# EAGLE design evolvulator (EAGLE 6.1)
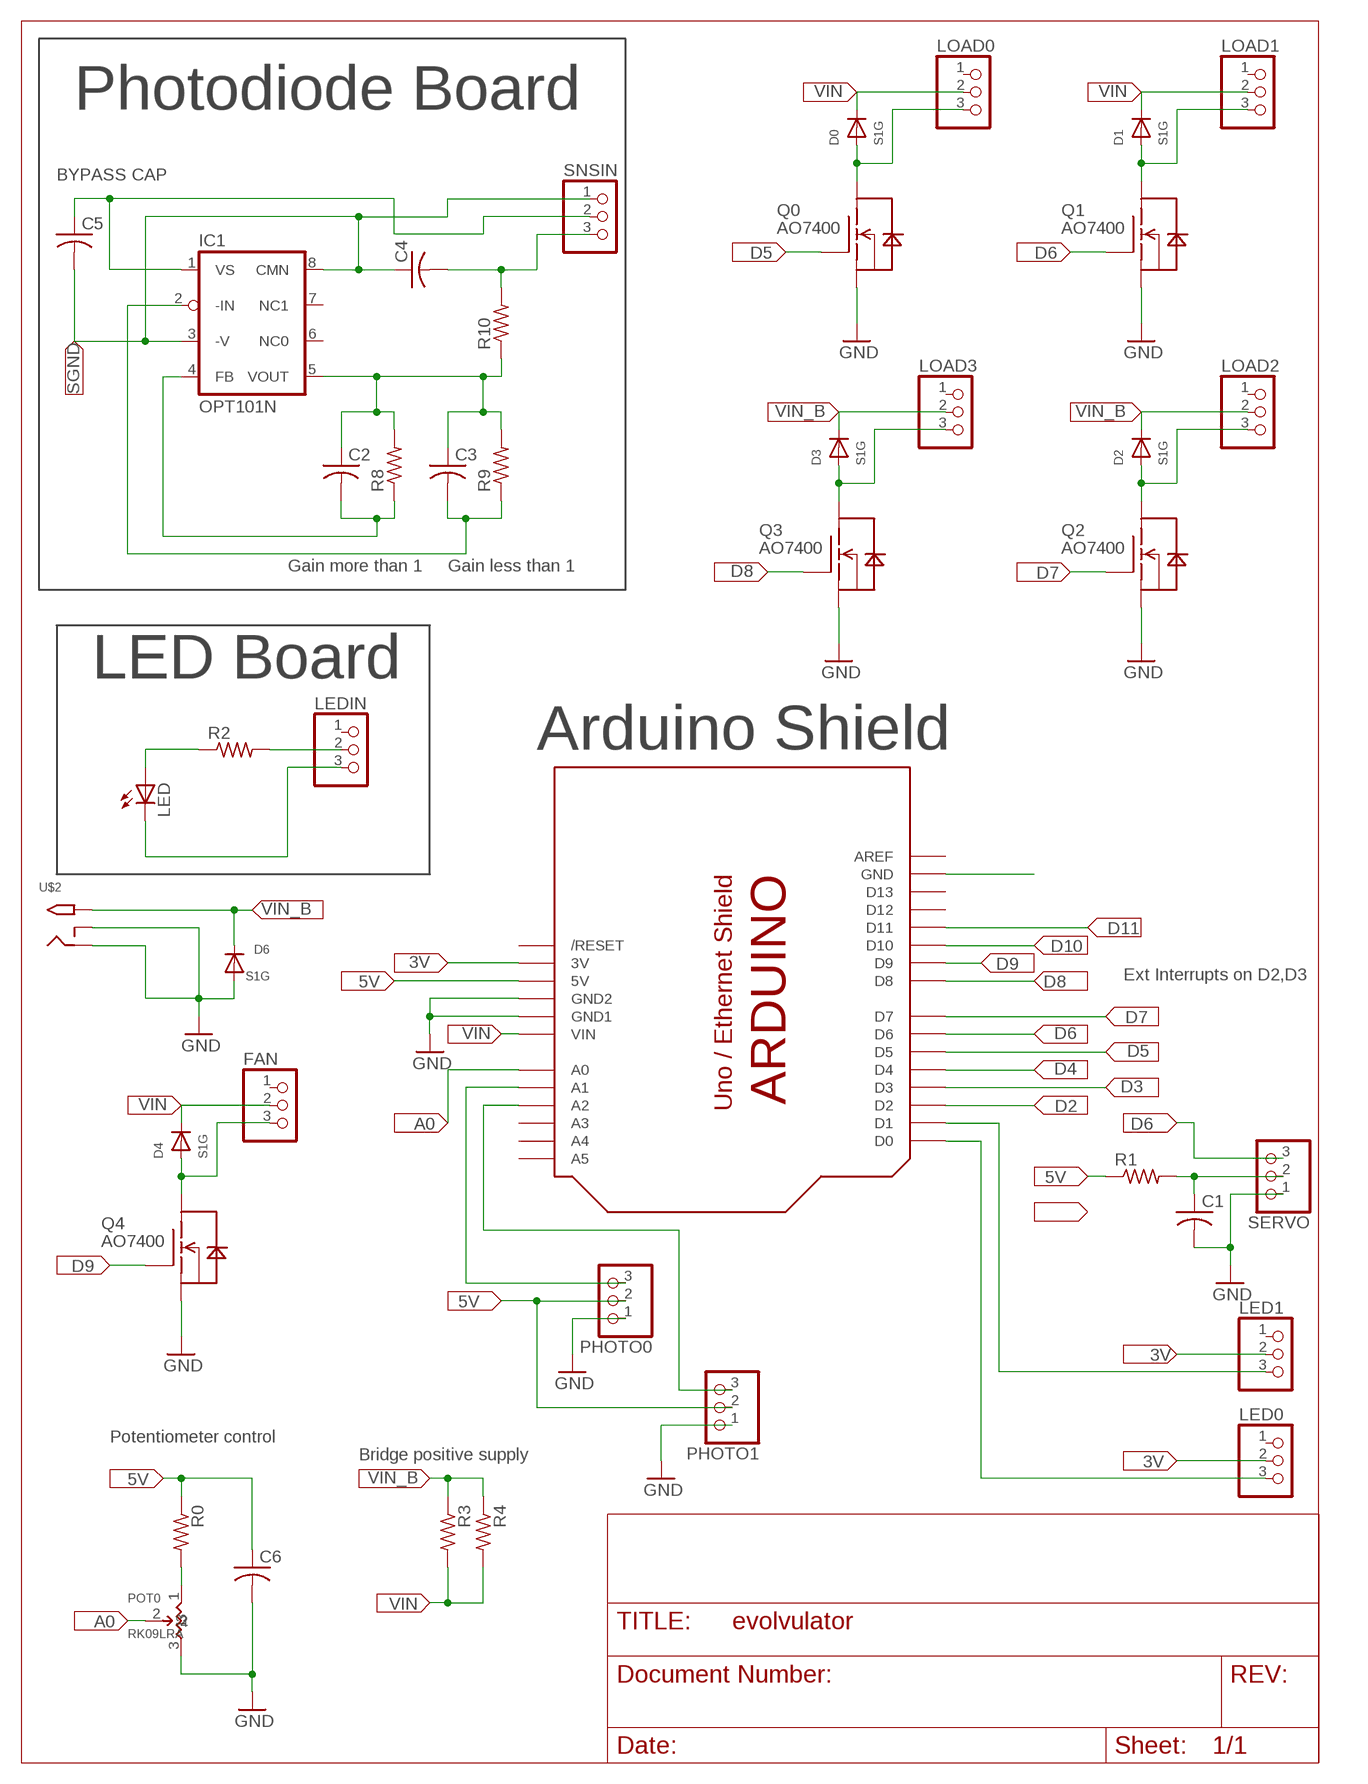
[diagram p0: schematic, sheet 1]

## Parts
C1  C_US  [C0603]
C2  C_US  [C0603]
C3  C_US  [C0603]
C4  C_US  [C0603]
C5  C_US  [C0603]
C6  C_US  [C0603]
D0  S1G  [SMA_DIODE]
D1  S1G  [SMA_DIODE]
D2  S1G  [SMA_DIODE]
D3  S1G  [SMA_DIODE]
D4  S1G  [SMA_DIODE]
D6  S1G  [SMA_DIODE]
FAN  PINHD-1X3  [1X03]
IC1  OPT101N  [DIL08-ROUND]
LED  LED3MM  [LED3MM]
LED0  PINHD-1X3  [1X03]
LED1  PINHD-1X3  [1X03]
LEDIN  PINHD-1X3NB  [1X03_NB]
LOAD0  PINHD-1X3  [1X03]
LOAD1  PINHD-1X3  [1X03]
LOAD2  PINHD-1X3  [1X03]
LOAD3  PINHD-1X3  [1X03]
PHOTO0  PINHD-1X3  [1X03]
PHOTO1  PINHD-1X3  [1X03]
POT0  RK09LRA  [ALPS_POT_9MM_RA]
Q0  AO7400  [SOT23_FET]
Q1  AO7400  [SOT23_FET]
Q2  AO7400  [SOT23_FET]
Q3  AO7400  [SOT23_FET]
Q4  AO7400  [SOT23_FET]
R0  R_US  [M0805]
R1  R_US  [M0805]
R2  R_US  [M0805]
R3  R_US  [M0805]
R4  R_US  [M0805]
R8  R_US  [M0805]
R9  R_US  [M0805]
R10  R_US  [M0805]
SERVO  PINHD-1X3  [1X03]
SNSIN  PINHD-1X3NB  [1X03_NB]
U$1  ARDUINOMAX  [ARDUINOSHIELD-MAX]
U$2  2.1MMJACKTHM  [PJ-102A]

## Nets
3V: LED0.2 LED1.2 U$1.3V
5V: C6.1 PHOTO0.2 PHOTO1.2 R0.1 R1.1 U$1.5V
A0: POT0.2 U$1.A0
D2: U$1.D2
D3: U$1.D3
D4: U$1.D4
D5: Q0.G U$1.D5
D6: Q1.G SERVO.3 U$1.D6
D7: Q2.G U$1.D7
D8: Q3.G U$1.D8
D9: Q4.G U$1.D9
D10: U$1.D10
D11: U$1.D11
D222: D3.A LOAD3.3 Q3.D
GND: C1.2 C6.2 D6.A PHOTO0.1 PHOTO1.1 POT0.3 Q0.S Q1.S Q2.S Q3.S Q4.S SERVO.1 U$1.GND1 U$1.GND2 U$2.RING U$2.RING_SW
N$1: C1.1 R1.2 SERVO.2
N$2: PHOTO0.3 U$1.A1
N$3: LED1.3 U$1.D1
N$4: D4.A FAN.3 Q4.D
N$5: LED0.3 U$1.D0
N$6: U$1.GND
N$7: POT0.1 R0.2
N$8: C3.2 IC1.2(-IN) R9.1
N$9: LEDIN.2 R2.2
N$10: C2.1 C3.1 IC1.5(VOUT) R8.2 R9.2 R10.1
N$11: C2.2 IC1.4(FB) R8.1
N$12: C5.1 IC1.1(VS) SNSIN.2
N$13: LED.A R2.1
N$14: LED.K(C) LEDIN.3
N$15: PHOTO1.3 U$1.A2
N$16: C4.2 R10.2 SNSIN.3
N$18: D0.A LOAD0.3 Q0.D
N$20: D1.A LOAD1.3 Q1.D
N$24: D2.A LOAD2.3 Q2.D
SGND: C4.1 C5.2 IC1.3(-V) IC1.8(CMN) SNSIN.1
VIN: D0.C D1.C D4.C FAN.2 LOAD0.2 LOAD1.2 R3.2 R4.2 U$1.VIN
VIN_B: D2.C D3.C D6.C LOAD2.2 LOAD3.2 R3.1 R4.1 U$2.TIP
Unconnected: FAN.1 IC1.6(NC0) IC1.7(NC1) LED0.1 LED1.1 LEDIN.1 LOAD0.1 LOAD1.1 LOAD2.1 LOAD3.1 U$1.A3 U$1.A4 U$1.A5 U$1.AREF U$1.D12 U$1.D13 U$1.RESET(/RESET)

## Notes on the sheet
- Photodiode Board
- BYPASS CAP
- Gain more than 1 | Gain less than 1
- LED Board
- Arduino Shield
- Ext Interrupts on D2,D3
- Potentiometer control
- Bridge positive supply

## Library data of the parts
C1-C6 = evolvulator:C_US
D0 D1-D4 D6 = evolvulator:S1G: http://search.digikey.com/us/en/products/S1G/S1GFSCT-ND/965720 Diode Type Standard Voltage - DC Reverse (Vr) (Max) 400V Current - Average Rectified (Io) 1A Voltage - Forward (Vf) (Max) @ If 1.1V @ 1A Speed Standard Recovery >500ns, > 200mA (Io)
FAN LED0 LED1 LEDIN LOAD0 LOAD1-LOAD3 PHOTO0 PHOTO1 SERVO SNSIN = evolvulator:PINHD-1X3: PIN HEADER
IC1 = evolvulator:OPT101: Photodiode Changed DIP package to have round (not oval) pin pads http://www.ti.com/lit/ds/symlink/opt101.pdf
LED = evolvulator:LED: All two pin LED's could be added hear. With Eagle 6.0 the same signal can be assingned to more than one pin for board mount LED's that might have additional pins per anode and cathode
POT0 = evolvulator:RK09L: Potentiometer Alps RK09L1120A2S for non linear taper, not too bad 688-RK09L1120036 for linear taper (being enod of lifed) 10k Ohm http://www.alps.com/products/WebObjects/catalog.woa/E/PDF/Potentiometer/MetalShaft/RK09L/RK09L.PDF
Q0 Q1-Q4 = evolvulator:AO7400: http://www.aosmd.com/res/data_sheets/AO7400.pdf Alpha & Omega Semiconductor 30 V N-Channel MOSFET ID 1.7A. RDS ON < 55 mOhm AO7400
R0 R1-R4 R8-R10 = evolvulator:R_US
U$1 = evolvulator:ARDUINO: Arduino Uno / Ethernet Shield Make a shield for the Arduino Uno or the Arduino Ethernet for the Standard pin configuration. The outline is on the DIMENSION layer, so if your board house uses it they will cut the outline to match. Derived from the Lady Ada eagle library http://www.ladyada.net/library/pcb/eaglelibrary.html
U$2 = evolvulator:2.1MMJACK: 2.1mm x 5.5mm THM DC jack with internal switch. Digikey part #PJ-102A, 4UCON part #05537 2.1mm x 5.5mm SMT DC jack with internal switch. Digikey part #PJ-002A-SMT, 4UCON part #03267 By microbuilder.eu & adafruit.com

## Board
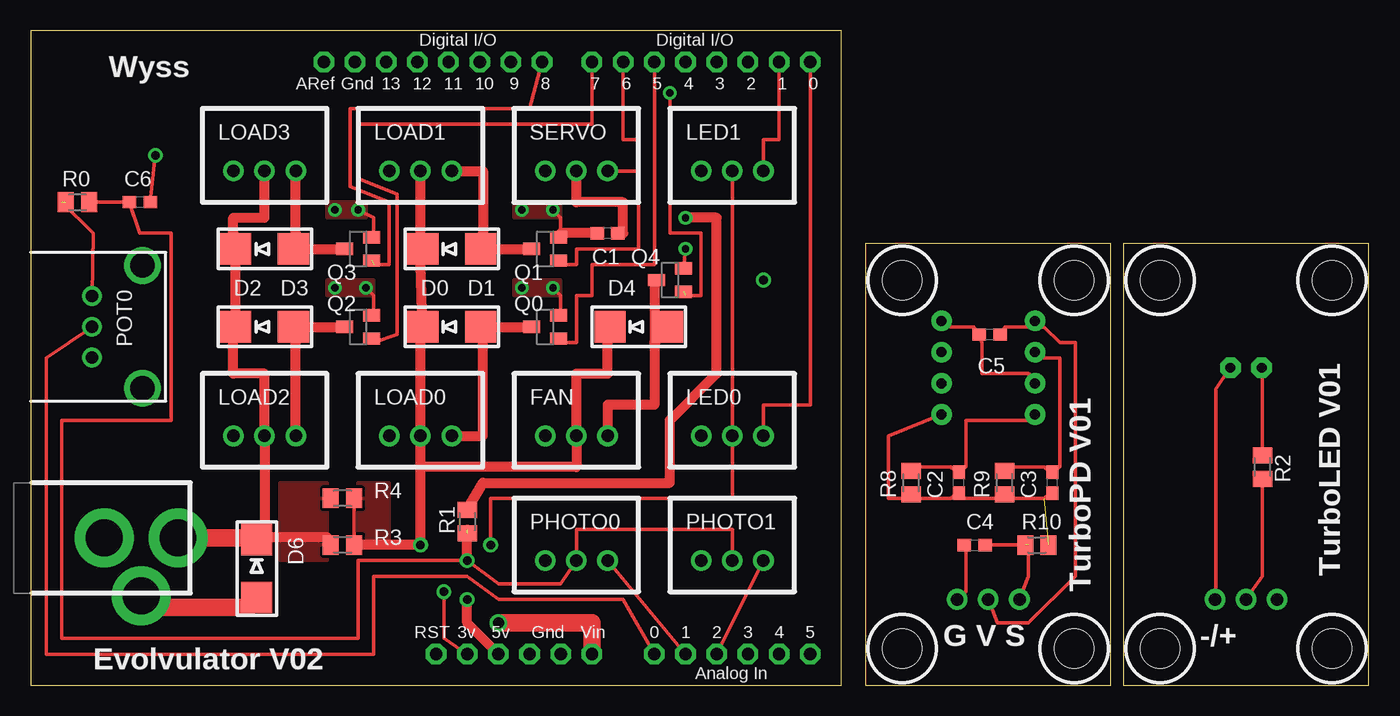
[diagram p1: board, top side]
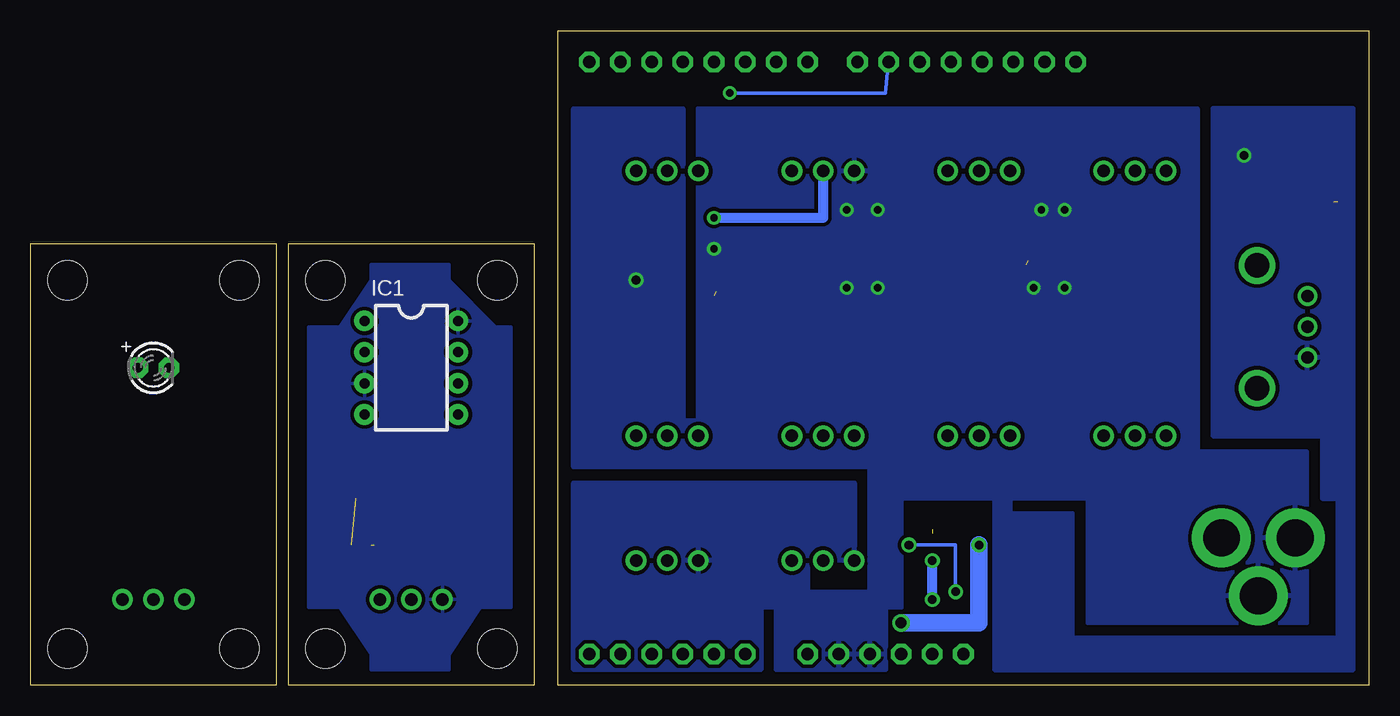
[diagram p2: board, bottom side, seen from below]

Size 109 x 53.34 mm. Coordinates in mm from the lower left corner, seen from the top.
Outline: 68,0 88,0 88,36 68,36 68,0
Outline: 89,36 89,0 109,0 109,36 89,36
Copper layers (1*16): Top 0.035mm / dielectric 1.5mm / Bottom 0.035mm
Design rules: minimum track width 12mil, minimum drill 20mil, track to track 12mil, track to pad 12mil, pad to pad 12mil, via to via 12mil, smd to smd 8mil, copper to edge 10mil, drill to drill 8mil, minimum pad ring 12mil, minimum via ring 10mil, stop-mask expansion 4mil, vias tented up to drill 25mil, thermal gap 10mil
Holes 3.2 mm at 71,3 71,33 85,3 85,33 92,33 92,3 106,3 106,33

### Footprints (pad centres in the part's own frame; a part is rotated, then mirrored left to right if it is on the bottom)
C0603 = smd 1.1 x 1: 1 -0.85,0; 2 0.85,0
SMA_DIODE = smd 2.54 x 2.54: A 2.349,0; C -2.349,0
1X03 = drill 1.016 pad 1.676: 1 -2.54,0; 2 0,0; 3 2.54,0
DIL08-ROUND = drill 0.813 pad 1.676: 1 -3.81,-3.81; 2 -1.27,-3.81; 3 1.27,-3.81; 4 3.81,-3.81; 5 3.81,3.81; 6 1.27,3.81; 7 -1.27,3.81; 8 -3.81,3.81
LED3MM = drill 0.813 pad 1.676 octagon: A -1.27,0; K 1.27,0
1X03_NB = drill 1.016 pad 1.676: 1 -2.54,0; 2 0,0; 3 2.54,0
ALPS_POT_9MM_RA = drill 1: 1 -2.5,5; 2 0,5; 3 2.5,5 | drill 2: MOUNT0 -5,9.1; MOUNT1 5,9.1
SOT23_FET = smd 1 x 1.4: D 0,1.1; G -0.95,-1.1; S 0.95,-1.1
M0805 = smd 1.3 x 1.6: 1 -0.95,0; 2 0.95,0
ARDUINOSHIELD-MAX = drill 1 pad 1.676 octagon: 3V 15.24,2.54; 5V 17.78,2.54; A0 30.48,2.54; A1 33.02,2.54; A2 35.56,2.54; A3 38.1,2.54; A4 40.64,2.54; A5 43.18,2.54; AREF 3.556,50.8; D0 43.18,50.8; D1 40.64,50.8; D2 38.1,50.8; D3 35.56,50.8; D4 33.02,50.8; D5 30.48,50.8; D6 27.94,50.8; D7 25.4,50.8; D8 21.336,50.8; D9 18.796,50.8; D10 16.256,50.8; D11 13.716,50.8; D12 11.176,50.8; D13 8.636,50.8; GND 6.096,50.8; GND1 22.86,2.54; GND2 20.32,2.54; RESET 12.7,2.54; VIN 25.4,2.54
PJ-102A = drill 3 pad 4.8: RING 0,6; RING_SW -4.7,3; TIP 0,0

### Placement (x,y rotation side)
C1  46.99,36.83 180 top
C2  75.61,16.51 90 top
C3  83.23,16.51 90 top
C4  76.88,11.43 0 top
C5  78.11,28.57 180 top
C6  8.89,39.37 0 top
D0  34.29,29.21 0 top
D1  34.29,35.56 0 top
D2  19.05,29.21 0 top
D3  19.05,35.56 0 top
D4  49.53,29.21 0 top
D6  18.41,9.53 270 top
FAN  44.45,20.32 0 top
IC1  78,25.88 270 bottom
LED  99,25.88 0 bottom
LED0  57.15,20.32 0 top
LED1  57.15,41.91 0 top
LEDIN  99,7 0 bottom
LOAD0  31.75,20.32 0 top
LOAD1  31.75,41.91 0 top
LOAD2  19.05,20.32 0 top
LOAD3  19.05,41.91 0 top
PHOTO0  44.45,10.16 0 top
PHOTO1  57.15,10.16 0 top
POT0  0,29.21 270 top
Q0  41.91,29.21 90 top
Q1  41.91,35.56 90 top
Q2  26.67,29.21 90 top
Q3  26.67,35.56 90 top
Q4  52.07,33.02 90 top
R0  3.81,39.37 180 top
R1  35.56,13.34 90 top
R2  100.33,17.78 270 top
R3  25.4,11.43 0 top
R4  25.4,15.24 0 top
R8  71.71,16.51 270 top
R9  79.33,16.51 270 top
R10  81.96,11.43 180 top
SERVO  44.45,41.91 0 top
SNSIN  78,7 0 top
U$1  20.32,0 0 top
U$2  12,12 90 top

### Tracks (layer width: path | path; a pad name or v marks a point on that pad's centre or on a via)
3V  (via drill 0.7)
  Top 0.305: U$1.3V 33.66,3.81 v33.66,7.62 | v37.47,11.43 37.47,15.24 57.15,15.24 LED0.2 LED1.2
  Bottom 0.305: v33.66,7.62 33.66,11.43 v37.47,11.43
5V  (via drill 0.7)  (1 unrouted)
  Top 0.305: PHOTO1.2 57.15,12.7 44.45,12.7 PHOTO0.2 43.18,8.26 38.1,8.26 v35.56,10.16 26.67,10.16 26.67,3.81 2.54,3.81 2.54,21.59 11.43,21.59 11.43,36.83 8.89,36.83 C6.1 R0.1
  Top 0.813: U$1.5V 35.56,5.08 v35.56,6.99 | v35.56,10.16 35.56,12.7
  Bottom 0.813: v35.56,6.99 v35.56,10.16
A0
  Top 0.305: U$1.A0 48.26,6.99 38.1,6.99 35.56,8.89 27.94,8.89 27.94,2.54 1.27,2.54 1.27,26.67 POT0.2
D5
  Top 0.305: Q0.G 43.18,27.94 44.45,27.94 44.45,31.75 45.72,31.75 45.72,34.29 50.8,34.29 U$1.D5
D6
  Top 0.305: Q1.G 43.18,34.29 44.45,34.29 44.45,35.56 49.53,35.56 49.53,41.91 | 49.53,41.91 49.53,44.45 48.26,44.45 U$1.D6 | SERVO.3 49.53,41.91
D7
  Top 0.305: U$1.D7 45.72,45.72 26.67,45.72 26.67,41.27 29.84,40.01 29.84,28.57 27.94,27.94 Q2.G
D8  (1 unrouted)
  Top 0.305: U$1.D8 40.64,46.99 26.04,46.99 26.04,40.64 29.21,39.37 29.21,34.29 27.94,34.29
D9  (via drill 0.6)  (1 unrouted)
  Top 0.305: v52.07,48.26 52.07,36.83 54.61,36.83 54.61,31.75 53.34,31.75
  Bottom 0.305: U$1.D9 39.37,48.26 v52.07,48.26
D222
  Top 0.813: LOAD3.3 21.59,36.83 D3.A Q3.D
GND  (via drill 0.6, 0.7)
  Top 0.305: C6.2 v10.16,43.18 | Q4.S v53.34,35.56 | v26.67,38.73 27.94,38.1 27.94,36.83 Q3.S | v27.3,32.38 27.94,31.75 27.94,30.48 Q2.S | 43.18,36.83 43.18,38.1 41.91,39.37 | Q0.S 43.18,30.48 43.18,31.75 v42.55,32.38
  Top 0.813: C1.2 43.18,36.83 Q1.S
  Top 1.422: D6.A 17.78,6.35 10.16,6.35 U$2.RING_SW
  other vias: 59.69,33.02 24.77,32.38 24.77,38.73 40.01,38.73 42.55,38.73 40.01,32.38
  pour Bottom: 1.27,46.99 12.7,46.99 12.7,20.32 3.81,20.32 3.81,15.24 2.54,15.24 2.54,3.81 24.13,3.81 24.13,13.97 29.21,13.97 29.21,16.51 30.48,16.51 30.48,1.27 1.27,1.27
  pour Bottom: 12.7,19.05 5.08,19.05 5.08,5.08 22.86,5.08 22.86,15.24 29.21,15.24 29.21,46.99 13.97,46.99 13.97,19.05
  pour Bottom: 38.1,6.35 39.37,6.35 39.37,1.27 48.26,1.27 48.26,6.35 49.53,6.35 49.53,1.27 64.77,1.27 64.77,16.51 41.91,16.51 41.91,10.16 45.72,10.16 45.72,7.62 40.64,7.62 40.64,17.78 54.61,17.78 54.61,46.99 29.21,46.99 29.21,15.24 38.1,15.24
  pour Bottom: 53.34,21.59 50.8,21.59 50.8,17.78 64.77,17.78 64.77,46.99 55.88,46.99 55.88,21.59
  pour Top: 39.37,33.02 39.37,31.75 43.18,31.75 43.18,33.02
  pour Top: 43.18,38.1 43.18,39.37 39.37,39.37 39.37,38.1
  pour Top: 24.13,38.1 27.3,38.1 27.3,39.37 24.13,39.37
  pour Top: 24.13,33.02 24.13,31.75 27.94,31.75 27.94,33.02
N$1  (via drill 0.6)
  Top 0.813: R1.2 36.83,16.51 52.07,16.51 52.07,21.59 55.88,25.4 55.88,38.1 v53.34,38.1 | C1.1 48.26,36.83 48.26,39.37 44.45,39.37 SERVO.2
  Bottom 0.813: v53.34,38.1 44.45,38.1 SERVO.2
N$2
  Top 0.305: U$1.A1 PHOTO0.3
N$3
  Top 0.305: LED1.3 59.69,44.45 60.96,44.45 U$1.D1
N$4
  Top 0.813: D4.A 50.8,27.94 | 50.8,27.94 50.8,22.86 46.99,22.86 FAN.3 | Q4.D 50.8,33.02 50.8,27.94
N$5
  Top 0.305: U$1.D0 63.5,22.86 59.69,22.86 LED0.3
N$7  (1 unrouted)
  Top 0.305: POT0.1 5.08,36.83 2.54,39.37
N$8
  Top 0.305: R9.1 80.01,17.78 82.55,17.78 C3.2 83.82,17.78 83.82,26.67 82.55,26.67 IC1.2
N$9
  Top 0.305: LEDIN.2 100.33,8.89 100.33,16.51 R2.2
N$10  (1 unrouted)
  Top 0.305: C3.1 82.55,15.24 80.01,15.24 R9.2 78.74,15.24 76.2,15.24 C2.1 74.93,15.24 72.39,15.24 R8.2 71.12,15.24 69.85,15.24 69.85,20.32 IC1.5
N$11
  Top 0.305: IC1.4 81.28,21.59 76.2,21.59 76.2,17.78 C2.2 74.93,17.78 72.39,17.78 R8.1
N$12
  Top 0.305: IC1.1 81.28,29.21 | 81.28,29.21 79.38,29.21 C5.1 | SNSIN.2 78.74,5.08 81.28,5.08 85.09,8.89 85.09,27.94 83.82,27.94 82.55,29.21 81.28,29.21
N$13
  Top 0.305: R2.1 100.33,25.4 LED.A
N$14
  Top 0.305: LED.K 96.52,24.13 96.52,7.62 LEDIN.3
N$15
  Top 0.305: PHOTO1.3 U$1.A2
N$16  (1 unrouted)
  Top 0.305: R10.2 C4.2 | SNSIN.3 81.28,8.89 81.28,11.43
N$18
  Top 0.813: Q0.D D0.A 36.83,27.94 36.83,20.32 LOAD0.3
N$20
  Top 0.813: LOAD1.3 36.83,41.91 36.83,36.83 D1.A Q1.D
N$24
  Top 0.813: Q2.D D2.A 21.59,27.94 LOAD2.3
SGND
  Top 0.305: IC1.8 74.93,29.21 76.83,29.21 C5.2 77.47,27.94 77.47,25.4 81.28,25.4 IC1.3 | C4.1 76.2,11.43 76.2,7.62 SNSIN.1
  pour Bottom: 69.85,8.89 69.85,6.35 72.39,6.35 74.93,2.54 74.93,1.27 81.28,1.27 81.28,2.54 83.82,6.35 86.36,6.35 86.36,27.94 86.36,29.21 83.82,29.21 81.28,33.02 81.28,34.29 74.93,34.29 74.93,33.02 71.12,29.21 69.85,29.21
VIN  (via drill 0.7, 0.9)
  Top 0.305: R4.2 R3.2 26.67,11.43
  Top 0.813: 31.75,17.78 v31.75,11.43 26.67,11.43 | 31.75,17.78 LOAD0.2 31.75,27.94 D0.C 31.75,34.29 D1.C 31.75,36.83 LOAD1.2 | 31.75,17.78 44.45,17.78 FAN.2 44.45,25.4 46.99,25.4 46.99,27.94 D4.C
  Top 1.422: U$1.VIN 45.72,5.08 v38.1,5.08
  Bottom 1.422: v38.1,5.08 31.75,5.08 v31.75,11.43
  pour Top: 26.67,11.43 29.21,11.43 29.21,16.51 26.67,16.51
VIN_B
  Top 0.813: R3.1 24.13,12.06 19.05,12.06 | 19.05,12.06 D6.C 17.78,11.43 | 19.05,12.06 LOAD2.2 19.05,25.4 16.51,25.4 16.51,29.21 D2.C D3.C 16.51,36.83 16.51,38.1 19.05,38.1 LOAD3.2
  Top 1.422: U$2.TIP 18.41,12 D6.C
  pour Top: 22.86,10.16 20.32,10.16 20.32,16.51 24.13,16.51 24.13,10.16

### Text on the board
tPlace: Wyss | TurboLED V01 | TurboPD V01 | G V S | -/+ | Evolvulator V02